# EAGLE design riser-1u-ethernet (EAGLE 6.2)
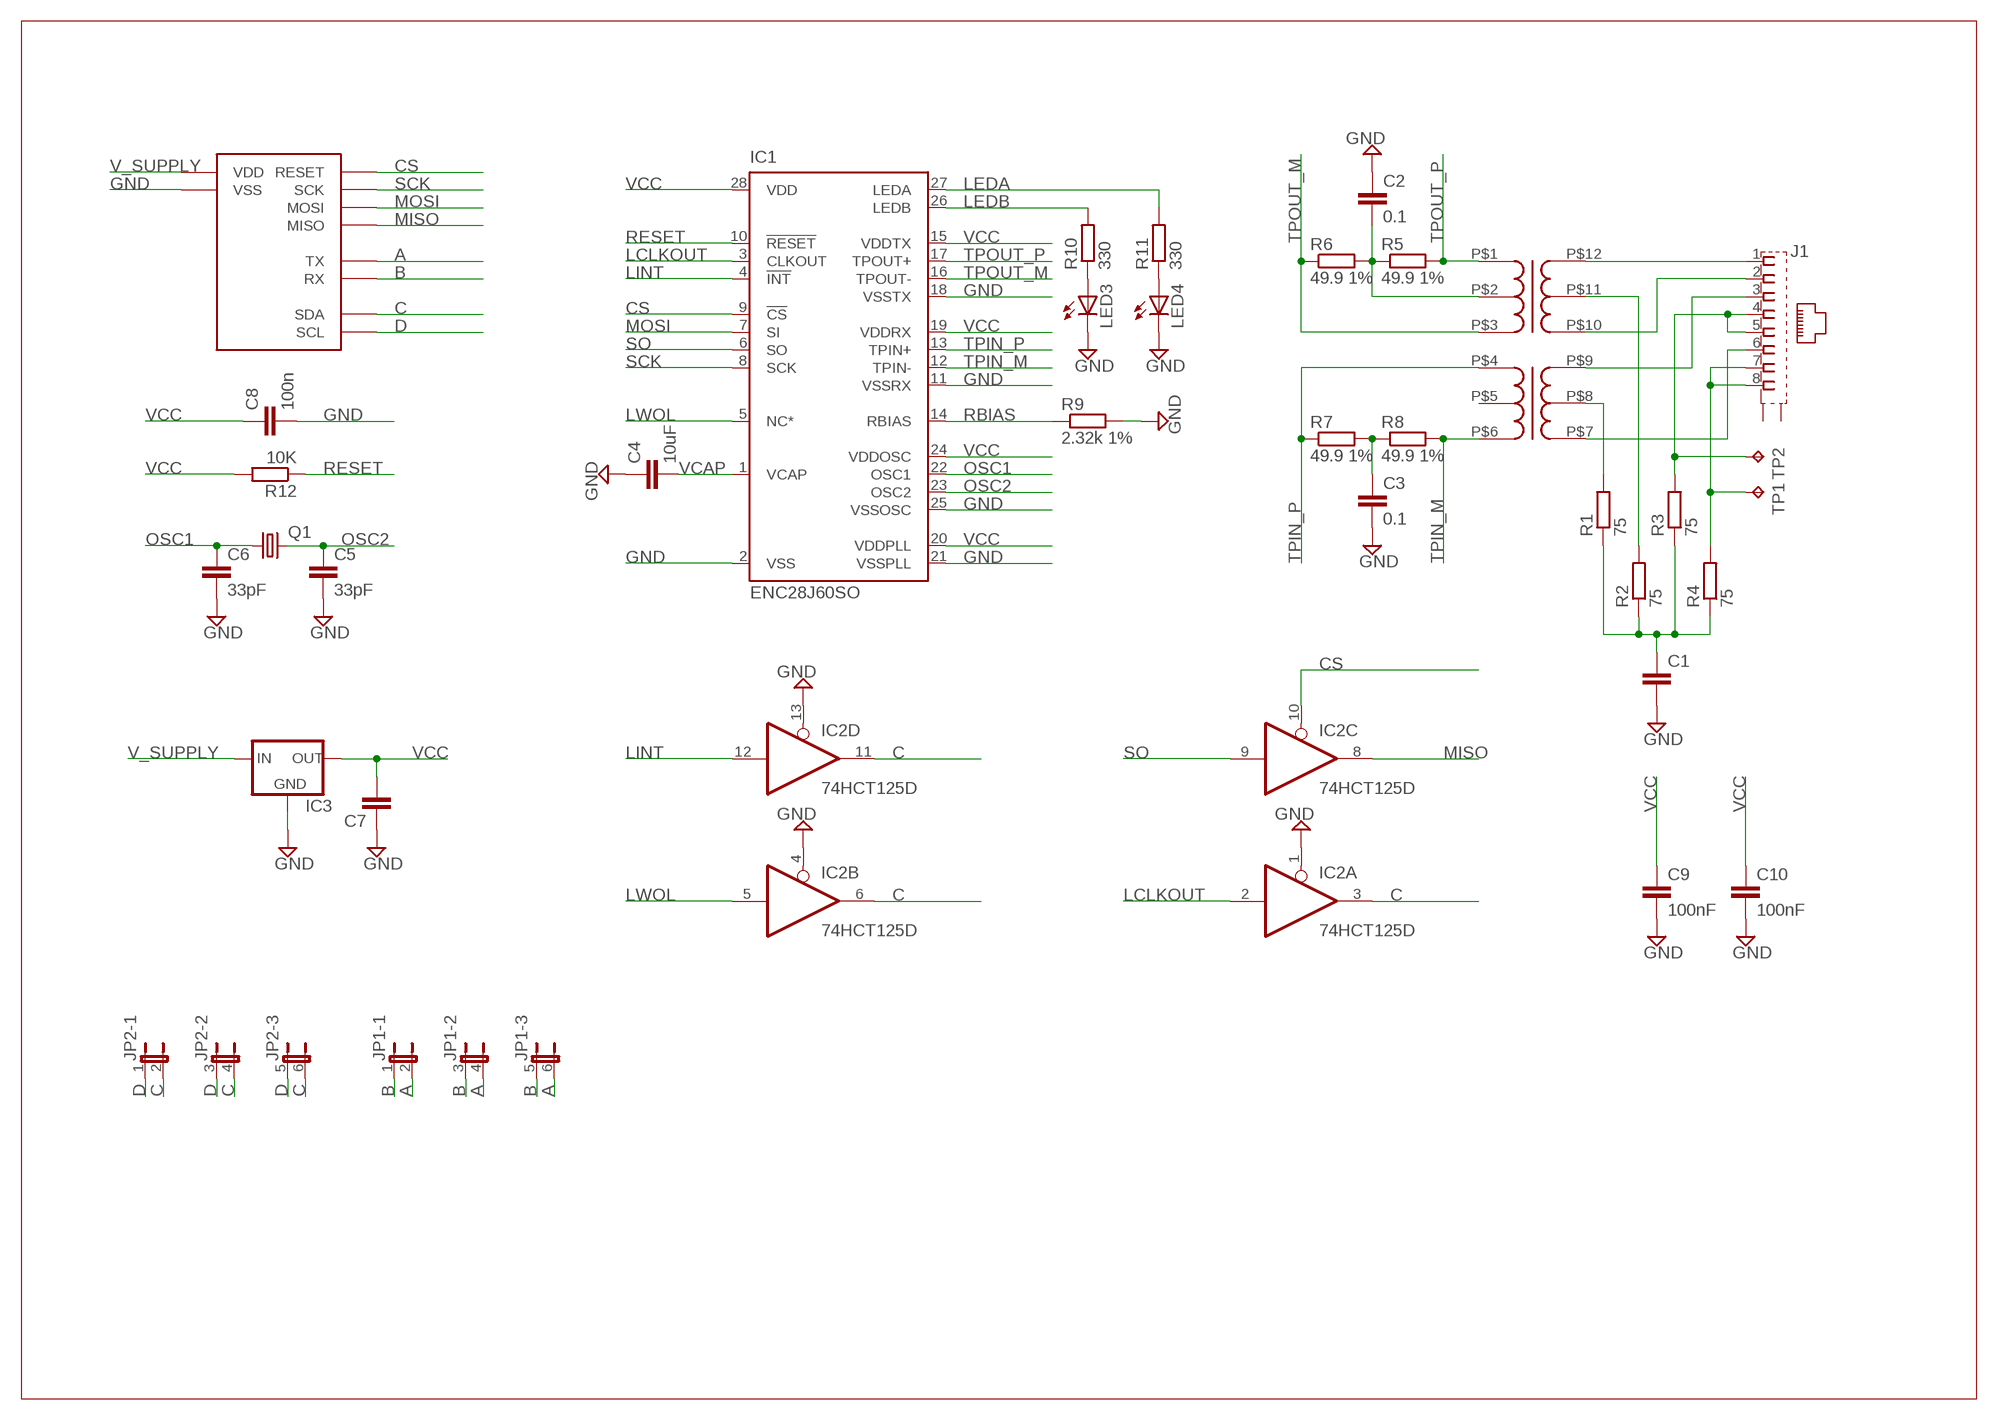
[diagram p0: schematic, sheet 1]

## Parts
C1  C-EU075-032X103  [C075-032X103]
C2  0.1  C-EUC0805  [C0805]
C3  0.1  C-EUC0805  [C0805]
C4  10uF  C-EUC1206  [C1206]
C5  33pF  C-EUC0805  [C0805]
C6  33pF  C-EUC0805  [C0805]
C7  C-EUC1206  [C1206]
C8  100n  C-EUC0805  [C0805]
C9  100nF  C-EUC0805  [C0805]
C10  100nF  C-EUC0805  [C0805]
IC1  ENC28J60SO  [SO28W]
IC2  74HCT125D  [SO14]
IC3  LM1117TO252  [TO252]
J1  555153-1  [555153-1]
JP1  JP3QE  [JP3Q]
JP2  JP3QE  [JP3Q]
LED3  LED3MM  [LED3MM]
LED4  LED3MM  [LED3MM]
Q1  CRYSTALHC49S  [HC49/S]
R1  75  R-EU_R0805  [R0805]
R2  75  R-EU_R0805  [R0805]
R3  75  R-EU_R0805  [R0805]
R4  75  R-EU_R0805  [R0805]
R5  49.9 1%  R-EU_R0805  [R0805]
R6  49.9 1%  R-EU_R0805  [R0805]
R7  49.9 1%  R-EU_R0805  [R0805]
R8  49.9 1%  R-EU_R0805  [R0805]
R9  2.32k 1%  R-EU_R0805  [R0805]
R10  330  R-EU_R0805  [R0805]
R11  330  R-EU_R0805  [R0805]
R12  10K  R-EU_R0805  [R0805]
TP1  TPPAD1-13  [P1-13]
TP2  TPPAD1-13  [P1-13]
U$1  UNI_BOARD_CONNECTOR_10  [UNI_BOARD_CONN_10]
U$2  ETHERNET_TRANSFORMER  [DIL-16-TRANSFORMER]

## Nets
A: JP1.2 JP1.4 JP1.6 U$1.C$7(TX)
B: JP1.1 JP1.3 JP1.5 U$1.C$9(RX)
C: IC2.3(A:O) IC2.6(B:O) IC2.11(D:O) JP2.2 JP2.4 JP2.6 U$1.C$8(SDA)
CS: IC1.9(!CS) IC2.10(C:OE) U$1.C$5(RESET)
D: JP2.1 JP2.3 JP2.5 U$1.C$10(SCL)
GND: C1.2 C2.1 C3.2 C4.1 C5.2 C6.2 C7.1 C8.2 C9.2 C10.2 IC1.2(VSS) IC1.11(VSSRX) IC1.18(VSSTX) IC1.21(VSSPLL) IC1.25(VSSOSC) IC2.1(A:OE) IC2.4(B:OE) IC2.13(D:OE) IC3.1(GND) LED3.K(C) LED4.K(C) R9.2 U$1.C$6(VSS)
LCLKOUT: IC1.3(CLKOUT) IC2.2(A:I)
LEDA: IC1.27(LEDA) R11.2
LEDB: IC1.26(LEDB) R10.2
LINT: IC1.4(!INT) IC2.12(D:I)
LWOL: IC1.5(NC*) IC2.5(B:I)
MISO: IC2.8(C:O) U$1.C$1(MISO)
MOSI: IC1.7(SI) U$1.C$4(MOSI)
N$1 [isolated]: J1.1 U$2.P$12(P16)
N$2 [isolated]: J1.2 U$2.P$10(P14)
N$3 [isolated]: J1.3 U$2.P$9(P11)
N$4 [isolated]: J1.6 U$2.P$7(P9)
N$5 [isolated]: R1.2 U$2.P$8(P10)
N$6 [isolated]: R2.2 U$2.P$11(P15)
N$7 [isolated]: J1.4 J1.5 R3.2 TP2.TP
N$8 [isolated]: J1.7 J1.8 R4.2 TP1.TP
N$9 [isolated]: C1.1 R1.1 R2.1 R3.1 R4.1
N$10: C2.2 R5.1 R6.2 U$2.P$2(P2)
N$11: C3.1 R7.2 R8.1
N$12: LED3.A R10.1
N$13: LED4.A R11.1
OSC1: C6.1 IC1.22(OSC1) Q1.1
OSC2: C5.1 IC1.23(OSC2) Q1.2
RBIAS: IC1.14(RBIAS) R9.1
RESET: IC1.10(!RESET) R12.1
SCK: IC1.8(SCK) U$1.C$3(SCK)
SO: IC1.6(SO) IC2.9(C:I)
TPIN_M: IC1.12(TPIN-) R8.2 U$2.P$6(P8)
TPIN_P: IC1.13(TPIN+) R7.1 U$2.P$4(P6)
TPOUT_M: IC1.16(TPOUT-) R6.1 U$2.P$3(P3)
TPOUT_P: IC1.17(TPOUT+) R5.2 U$2.P$1(P1)
V_SUPPLY: IC3.2(IN) U$1.C$2(VDD)
VCAP: C4.2 IC1.1(VCAP)
VCC: C7.2 C8.1 C9.1 C10.1 IC1.15(VDDTX) IC1.19(VDDRX) IC1.20(VDDPLL) IC1.24(VDDOSC) IC1.28(VDD) IC3.3(OUT) R12.2
Unconnected: J1.G1(S1) J1.G2(S2) U$2.P$5(P7)

## Power pins joined to a net without a drawn wire
GND: IC2.7(P:GND)
VCC: IC2.14(P:VCC)

## Library data of the parts
C1-C10 = rcl:C-EU: CAPACITOR, European symbol
IC1 = my-microchip-ENC28J60:ENC28J60: Stand-Alone Ethernet Controller with SPI Interface Source: http://ww1.microchip.com/downloads/en/DeviceDoc/39662c.pdf
IC2 = 74xx-eu:74*125: Quad bus BUFFER, 3-state
IC3 = my-v-reg-3:LM1117
J1 = con-amp:555153-1: AMP connector
JP1 JP2 = jumper:JP3QE: JUMPER
LED3 LED4 = led:LED: LED OSRAM: - CHIPLED LG R971, LG N971, LY N971, LG Q971, LY Q971, LO R971, LY R971 LH N974, LH R974 LS Q976, LO Q976, LY Q976 LO Q996 - Hyper CHIPLED LW Q18S LB Q993, LB Q99A, LB R99A - SideLED LS A670, LO A670, LY A670, LG A670, LP A670 LB A673, LV A673, LT A673, LW A673 LH A674 LY A675 LS A676, LA A676, LO A676, LY A676, LW A676 LS A679, LY A679, LG A679 - Hyper Micro SIDELED® LS Y876, LA Y876, LO Y876, LY Y876 LT Y87S - SmartLED LW L88C, LW L88S LB L89C, LB L89S, LG L890 LS L89K, LO L89K, LY L89K LS L896, LA L896, LO L896, LY L896 - TOPLED LS T670, LO T670, LY T670, LG T670, LP T670 LSG T670, LSP T670, LSY T670, LOP T670, LYG T670 LG T671, LOG T671, LSG T671 LB T673, LV T673, LT T673, LW T673 LH T674 LS T676, LA T676, LO T676, LY T676, LB T676, LH T676, LSB T676, LW T676 LB T67C, LV T67C, LT T67C, LS T67K, LO T67K, LY T67K, LW E67C LS E67B, LA E67B, LO E67B, LY E67B, LB E67C, LV E67C, LT E67C LW T67C LS T679, LY T679, LG T679 LS T770, LO T770, LY T770, LG T770, LP T770 LB T773, LV T773, LT T773, LW T773 LH T774 LS E675, LA E675, LY E675, LS T675 LS T776, LA T776, LO T776, LY T776, LB T776 LHGB T686 LT T68C, LB T68C - Hyper Mini TOPLED® LB M676 - Mini TOPLED Santana® LG M470 LS M47K, LO M47K, LY M47K Source: http://www.osram.convergy.de LUXEON: - LUMILED® LXK2-PW12-R00, LXK2-PW12-S00, LXK2-PW14-U00, LXK2-PW14-V00 LXK2-PM12-R00, LXK2-PM12-S00, LXK2-PM14-U00 LXK2-PE12-Q00, LXK2-PE12-R00, LXK2-PE12-S00, LXK2-PE14-T00, LXK2-PE14-U00 LXK2-PB12-K00, LXK2-PB12-L00, LXK2-PB12-M00, LXK2-PB14-N00, LXK2-PB14-P00, LXK2-PB14-Q00 LXK2-PR12-L00, LXK2-PR12-M00, LXK2-PR14-Q00, LXK2-PR14-R00 LXK2-PD12-Q00, LXK2-PD12-R00, LXK2-PD12-S00 LXK2-PH12-R00, LXK2-PH12-S00 LXK2-PL12-P00, LXK2-PL12-Q00, LXK2-PL12-R00 Source: www.luxeon.com KINGBRIGHT: KA-3528ASYC Source: www.kingbright.com
Q1 = crystal:CRYSTAL: CRYSTAL
R1-R12 = rcl:R-EU_: RESISTOR, European symbol
TP1 TP2 = testpad:TP: Test pad
U$1 = my-uni-board-conn:UNI_BOARD_CONNECTOR_10
U$2 = my-valor-FL1066:ETHERNET_TRANSFORMER

## Net classes
1 isolated: width 0.813 mm, clearance 2.54 mm

## Board
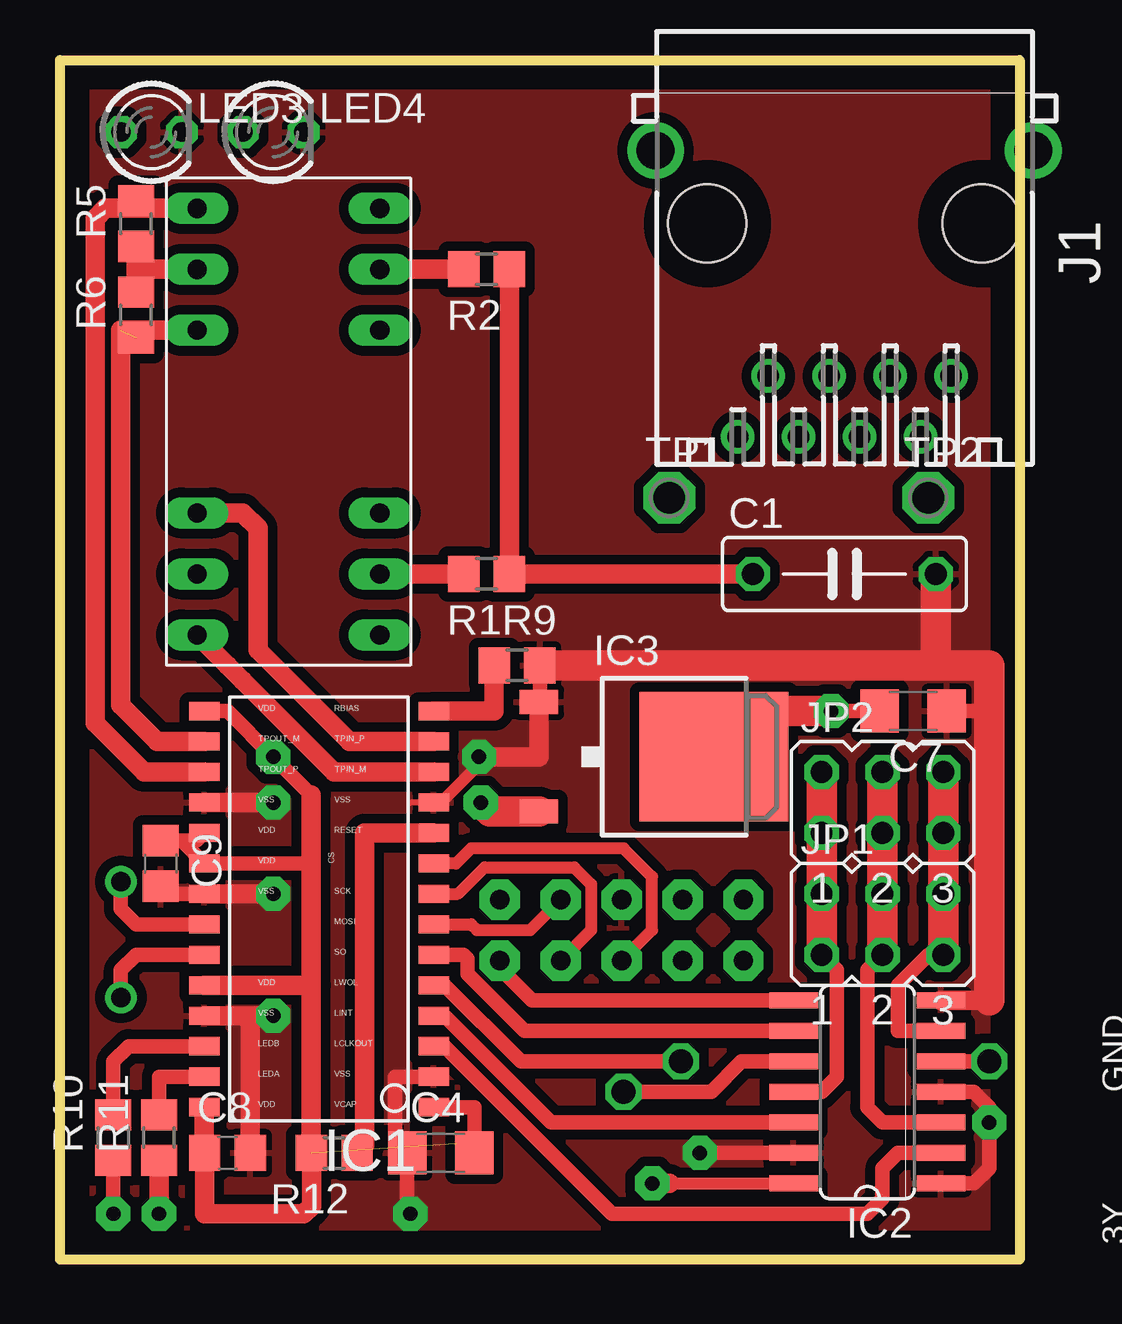
[diagram p1: board, top side]
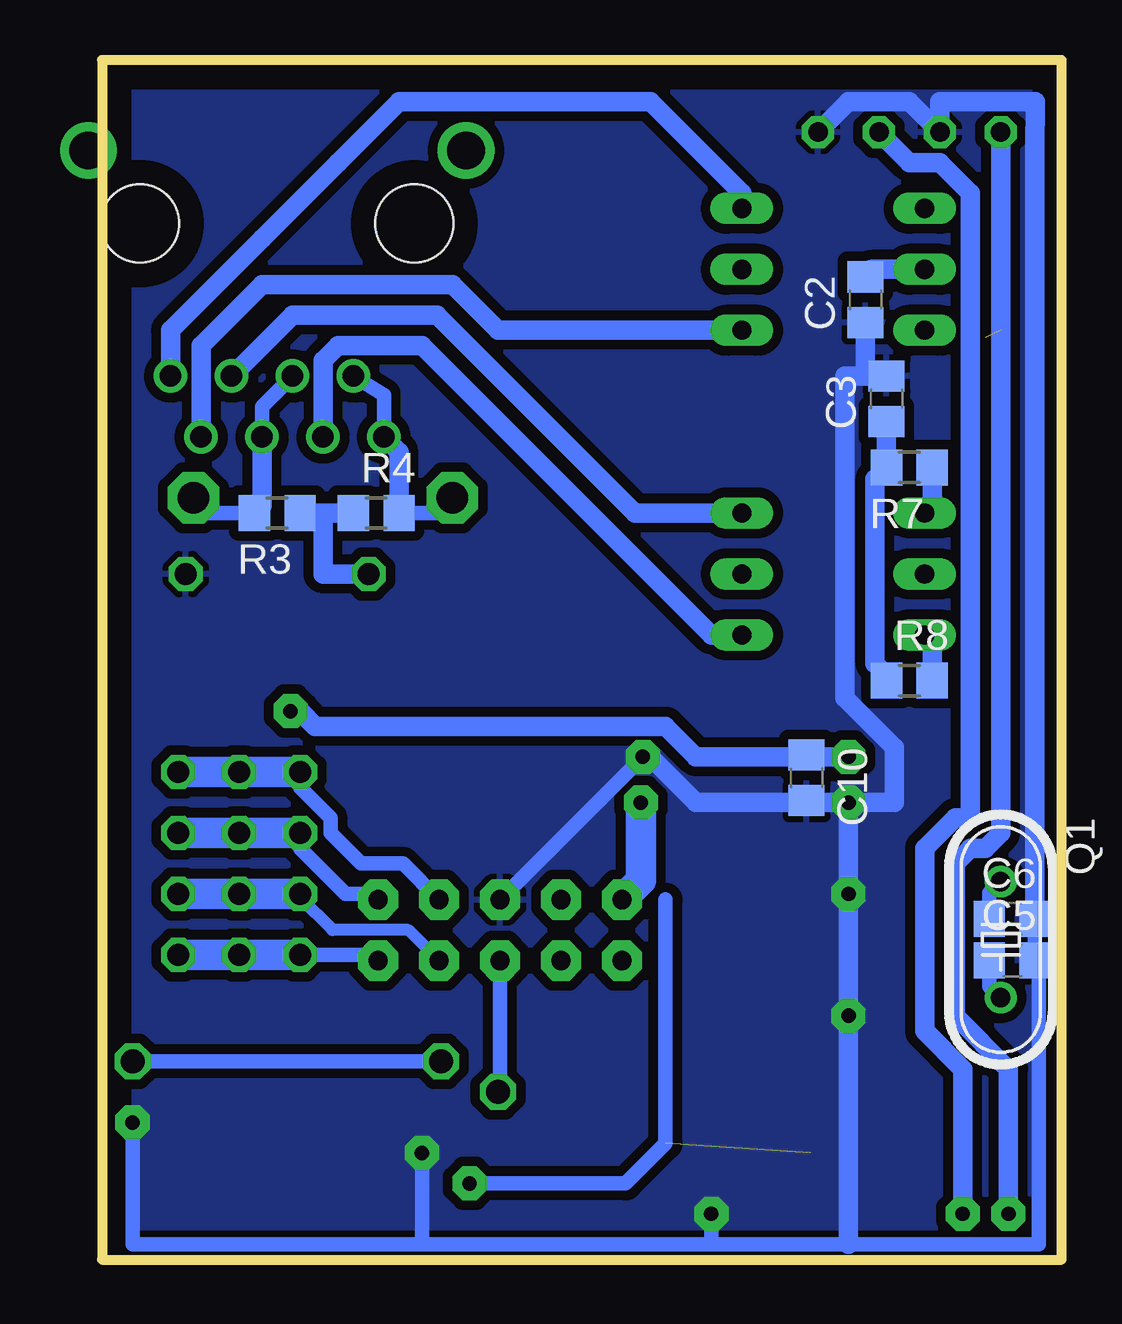
[diagram p2: board, bottom side, seen from below]

Size 40 x 50 mm. Coordinates in mm from the lower left corner, seen from the top.
Outline: 0,0 0,50 40,50 40,0 0,0
Copper layers (1*16): Top 0.035mm / dielectric 1.5mm / Bottom 0.035mm
Design rules: minimum track width 10mil, minimum drill 24mil, track to track 8mil, track to pad 8mil, pad to pad 8mil, via to via 8mil, smd to smd 8mil, copper to edge 40mil, drill to drill 8mil, minimum pad ring 10mil, minimum via ring 8mil, stop-mask expansion 4mil, vias tented up to drill 0mil, thermal gap 10mil

### Footprints (pad centres in the part's own frame; a part is rotated, then mirrored left to right if it is on the bottom)
C075-032X103 = drill 0.914 octagon: 1 -3.81,0; 2 3.81,0
C0805 = smd 1.3 x 1.5: 1 -0.95,0; 2 0.95,0
C1206 = smd 1.6 x 1.8: 1 -1.4,0; 2 1.4,0
SO28W = smd 0.762 x 1.27: 1 -7.62,-4.78; 2 -6.35,-4.78; 3 -5.08,-4.78; 4 -3.81,-4.78; 5 -2.54,-4.78; 6 -1.27,-4.78; 7 0,-4.78; 8 1.27,-4.78; 9 2.54,-4.78; 10 3.81,-4.78; 11 5.08,-4.78; 12 6.35,-4.78; 13 7.62,-4.78; 14 8.89,-4.78; 15 8.89,4.78; 16 7.62,4.78; 17 6.35,4.78; 18 5.08,4.78; 19 3.81,4.78; 20 2.54,4.78; 21 1.27,4.78; 22 0,4.78; 23 -1.27,4.78; 24 -2.54,4.78; 25 -3.81,4.78; 26 -5.08,4.78; 27 -6.35,4.78; 28 -7.62,4.78
SO14 = smd 0.66 x 2.032: 1 -3.81,-3.073; 2 -2.54,-3.073; 3 -1.27,-3.073; 4 0,-3.073; 5 1.27,-3.073; 6 2.54,-3.073; 7 3.81,-3.073; 8 3.81,3.073; 9 2.54,3.073; 10 1.27,3.073; 11 0,3.073; 12 -1.27,3.073; 13 -2.54,3.073; 14 -3.81,3.073
TO252 = smd 1 x 1.6: 1 -2.28,-6.07; 2 2.28,-6.07 | smd 5.4 x 6.2: 3 0,1.23
555153-1 = drill 0.889: 1 -4.445,6.35; 2 -3.175,8.89; 3 -1.905,6.35; 4 -0.635,8.89; 5 0.635,6.35; 6 1.905,8.89; 7 3.175,6.35; 8 4.445,8.89 | drill 1.575 pad 2.184: G1 -7.874,-3.048; G2 7.874,-3.048 | hole 3.251: -5.715,0; 5.715,0
JP3Q = drill 0.914 octagon: 1 -2.54,-1.27; 2 -2.54,1.27; 3 0,-1.27; 4 0,1.27; 5 2.54,-1.27; 6 2.54,1.27
LED3MM = drill 0.813 octagon: A -1.27,0; K 1.27,0
HC49/S = drill 0.813: 1 -2.413,0; 2 2.413,0
R0805 = smd 1.3 x 1.5: 1 -0.95,0; 2 0.95,0
P1-13 = drill 1.321 pad 2.159 octagon: TP 0,0
UNI_BOARD_CONN_10 = drill 0.8 pad 1.676 octagon: C$1 6.35,1.27; C$2 6.35,-1.27; C$3 3.81,1.27; C$4 3.81,-1.27; C$5 1.27,1.27; C$6 1.27,-1.27; C$7 -1.27,1.27; C$8 -1.27,-1.27; C$9 -3.81,1.27; C$10 -3.81,-1.27
DIL-16-TRANSFORMER = drill 0.8 long: P$1 -3.81,8.89; P$2 -3.81,6.35; P$3 -3.81,3.81; P$4 -3.81,-3.81; P$5 -3.81,-6.35; P$6 -3.81,-8.89; P$7 3.81,-8.89; P$8 3.81,-6.35; P$9 3.81,-3.81; P$10 3.81,3.81; P$11 3.81,6.35; P$12 3.81,8.89

### Placement (x,y rotation side)
C1  32.7,28.57 0 top
C2  8.18,40.01 90 bottom
C3  7.3,35.88 90 bottom
C4  15.88,4.45 0 top
C5  2.06,12.46 0 bottom
C6  2.06,14.21 0 bottom
C7  35.56,22.86 180 top
C8  6.99,4.45 0 top
C9  4.21,16.51 270 top
C10  10.64,20.08 270 bottom
IC1  10.79,13.97 90 top
IC2  33.66,6.99 90 top
IC3  26.04,20.95 270 top
J1  32.7,43.18 180 top
JP1  34.29,13.97 0 top
JP2  34.29,19.05 0 top
LED3  3.81,46.99 0 top
LED4  8.89,46.99 0 top
Q1  2.54,13.34 270 bottom
R1  17.78,28.57 180 top
R2  17.78,41.27 180 top
R3  32.7,31.11 180 bottom
R4  28.57,31.11 0 bottom
R5  3.17,43.18 90 top
R6  3.17,39.37 90 top
R7  6.35,33.02 180 bottom
R8  6.35,24.13 0 bottom
R9  19.05,24.77 0 top
R10  2.22,5.08 90 top
R11  4.13,5.08 90 top
R12  11.43,4.45 180 top
TP1  25.4,31.75 0 top
TP2  36.2,31.75 0 top
U$1  24.68,13.73 180 top
U$2  9.53,34.92 0 top

### Tracks (layer width: path | path; a pad name or v marks a point on that pad's centre or on a via)
A
  Bottom 0.508: U$1.C$7 27.23,13.73 30.4,13.73 31.75,15.08 JP1.2
  Bottom 1.27: JP1.2 JP1.4 JP1.6
B
  Bottom 0.61: U$1.C$9 28.73,12.7 JP1.1
  Bottom 1.27: JP1.1 JP1.3 JP1.5
C
  Top 0.61: IC2.6 34.92,9.53 34.92,11.43 36.2,12.7 36.83,12.7 | 34.29,12.7 33.66,12.06 33.66,6.35 34.29,5.71 IC2.3 | IC2.11 31.75,6.99 32.38,7.62 32.38,12.06 31.75,12.7
  Top 1.27: JP2.6 36.83,12.7 | JP2.4 34.29,12.7 | 31.75,12.7 JP2.2
  Bottom 0.61: U$1.C$8 27.46,16.51 29.21,16.51 30.48,17.78 30.48,18.41 31.75,19.68 JP2.2
  Bottom 1.27: JP2.2 JP2.4 JP2.6
CS  (via drill 1 pad 1.02)
  Top 0.508: IC1.9 16.51,16.51 17.14,17.14 23.5,17.14 24.69,15.95 24.69,13.73 U$1.C$5
  Top 0.61: v23.5,6.99 27.15,6.99 28.42,8.26 IC2.10
  Bottom 0.61: U$1.C$5 23.41,7.07 v23.5,6.99
D
  Bottom 0.61: U$1.C$10 28.73,15.24 29.84,15.24 31.75,17.14 JP2.1
  Bottom 1.27: JP2.1 JP2.3 JP2.5
GND  (via drill 0.6 pad 1.42)
  Top 0.254: IC1.11 15.3,19.05 14.61,19.05
  Top 0.508: IC1.11 15.88,19.05 17.78,20.95
  Top 0.61: R9.2 20,23.27 IC3.1 | IC1.2 13.97,7.62 13.97,4.32 | 13.97,4.32 14.47,3.81 14.47,2.04 v14.61,1.91 | v17.46,20.95 17.78,20.95 | IC2.4 38.1,6.99 38.73,6.35 v38.73,5.71 38.73,3.81 38.1,3.17 IC2.1 | v26.67,4.45 IC2.13 | C4.1 13.97,4.45 13.97,4.32 | 38.73,22.86 C7.1 | C9.2 4.53,15.24 IC1.21
  Top 0.813: v8.89,19.05 IC1.18 | v8.89,10.16 7.86,10.16 | 7.86,10.16 IC1.25 | 38.73,10.79 IC2.7 | C8.2 7.93,10.08 7.86,10.16 | 17.78,20.95 19.96,20.95 IC3.1 | v8.89,15.24 IC1.21 v8.89,15.24
  Top 1.27: R9.2 36.51,24.77 | 36.51,24.77 C1.2 | 38.73,10.79 38.73,22.86 38.73,24.77 36.51,24.77
  Bottom 0.61: C5.2 C6.2 | C5.2 | 23.25,15 U$1.C$6 v17.46,20.95 | 14.61,0.64 8.89,0.64 0.95,0.64 0.95,12.3 C5.2 | 14.61,0.64 22.15,0.64 26.67,0.64 | 14.61,0.64 v14.61,1.91 | v38.73,5.71 38.73,0.64 26.67,0.64 | 26.67,0.64 v26.67,4.45 | C10.2 8.89,19.13 v8.89,19.05
  Bottom 0.813: LED4.K 8.89,48.26 6.35,48.26 LED3.K 5.08,48.26 1.11,48.26 1.11,46.2 C6.2 | v8.89,19.05 v8.89,15.24 8.89,10.79 v8.89,10.16 8.89,0.64 | v17.46,20.95 17.14,20.95 15.24,19.05 v8.89,19.05 | 8.26,36.83 9.05,36.83 9.05,23.42 6.99,21.35 6.99,19.05 v8.89,19.05 | 8.26,36.83 C3.2 | C2.1 8.18,36.91 arc90 8.26,36.83
  pour Bottom (isolate 0.406): 0,50.16 40.01,50.16 40.01,0 0,0
  pour Top (isolate 0.406): 0,50.16 40.01,50.16 40.01,0 0,0
LCLKOUT
  Top 0.61: IC1.3 16.03,8.89 23.02,1.91 33.66,1.91 34.29,2.54 34.29,3.81 34.92,4.45 IC2.2
LEDA
  Top 0.61: IC1.27 4.13,7.62 R11.2
LEDB
  Top 0.61: IC1.26 2.86,8.89 2.22,8.26 R10.2
LINT
  Top 0.254: IC1.4 15.36,10.16
  Top 0.61: IC1.4 16.03,10.16 20.48,5.71 IC2.12
LWOL  (via drill 1 pad 1.02)
  Top 0.61: IC1.5 16.03,11.43 19.21,8.26 v25.88,8.26 | v38.73,8.26 IC2.5
  Bottom 0.61: v25.88,8.26 v38.73,8.26
MISO
  Top 0.61: IC2.8 19.68,10.79 18.34,12.14 U$1.C$1
MOSI
  Top 0.508: U$1.C$4 19.61,13.73 17.38,13.73 17.14,13.97 IC1.7
N$1
  Bottom 0.813: J1.1 37.15,38.73 33.34,42.55 30.16,45.72 27.62,48.26 17.14,48.26 13.34,44.45 U$2.P$12
N$2
  Bottom 0.813: J1.2 35.88,38.1 33.34,40.64 25.4,40.64 23.5,38.73 U$2.P$10
N$3
  Bottom 0.813: U$2.P$9 17.78,31.11 26.04,39.37 32.07,39.37 J1.3
N$4
  Bottom 0.813: J1.6 30.8,37.47 30.16,38.1 26.67,38.1 14.61,26.04 U$2.P$7
N$5
  Top 0.813: U$2.P$8 R1.2
N$6
  Top 0.813: U$2.P$11 R2.2
N$7
  Bottom 0.61: J1.5 33.34,35.56 J1.4 | TP2.TP 35.56,31.11 R3.2
  Bottom 0.813: J1.4 33.34,31.43 R3.2
N$8
  Bottom 0.61: J1.8 28.26,36.04 J1.7 | TP1.TP 26.04,31.11 R4.2
  Bottom 0.813: R4.2 27.62,33.66 J1.8
N$9
  Top 0.813: R2.1 R1.1 C1.1
  Bottom 0.813: 30.8,31.11 R3.1 | 30.8,31.11 30.8,28.57 C1.1 | 30.8,31.11 R4.1
N$10
  Top 0.813: 3.17,41.27 R5.1 | 3.17,41.27 U$2.P$2 | R6.2 3.17,41.27
  Bottom 0.813: U$2.P$2 7.86,41.27 arc-90 C2.2
N$11
  Bottom 0.813: R8.1 7.3,24.37 7.78,24.84 7.78,32.54 R7.2 arc90 R7.2 C3.1
N$12  (via drill 0.6 pad 1.42)
  Top 0.61: v2.22,1.91 R10.1
  Bottom 0.813: LED3.A 2.54,45.09 2.54,17.78 3.17,17.14 3.81,17.14 4.45,16.51 4.45,10.16 2.22,7.94 v2.22,1.91
N$13  (via drill 0.6 pad 1.42)
  Top 0.813: v4.13,1.91 R11.1
  Bottom 0.813: LED4.A 6.35,45.72 5.08,45.72 3.81,44.45 3.81,18.41 4.45,18.41 5.71,17.14 5.71,9.53 4.13,7.94 v4.13,1.91
OSC1
  Top 0.61: IC1.22 3.17,13.97 2.54,14.61 Q1.1
  Bottom 0.61: C6.1 3.01,15.27 Q1.1
OSC2
  Top 0.61: IC1.23 3.17,12.7 2.54,12.06 Q1.2
  Bottom 0.61: C5.1 3.01,11.4 Q1.2
RBIAS
  Top 0.813: R9.1 18.1,22.86 IC1.14
RESET
  Top 0.813: IC1.10 12.7,17.78 12.7,4.76 R12.1
SCK
  Top 0.508: U$1.C$3 22.15,13.73 22.15,15.64 21.43,16.35 17.7,16.35 16.59,15.24 IC1.8
SO
  Top 0.61: IC1.6 16.83,12.7 16.99,12.54 16.99,11.91 19.37,9.53 IC2.9
TPIN_M
  Top 0.813: U$2.P$6 6.99,24.77 7.62,24.13 11.43,20.32 IC1.12
  Bottom 0.813: 6.35,26.04 U$2.P$6 5.4,25.72 R8.2
TPIN_P
  Top 0.813: U$2.P$4 7.62,31.11 8.26,30.48 8.26,25.4 12.06,21.59 IC1.13
  Bottom 0.813: R7.1 5.4,31.43 U$2.P$4
TPOUT_M  (1 unrouted)
  Top 0.813: U$2.P$3 2.53,38.73 2.53,23.12 4.06,21.59 IC1.16
TPOUT_P
  Top 0.813: 3.17,43.81 1.89,43.81 1.46,43.38 1.46,22.36 3.5,20.32 IC1.17 | 3.17,43.81 U$2.P$1 | 3.17,43.81 R5.2
V_SUPPLY  (via drill 0.6 pad 1.42)
  Top 1.27: v17.54,19.05 17.92,18.68 IC3.2
  Bottom 1.27: U$1.C$2 17.54,15.79 v17.54,19.05
VCAP
  Top 0.61: IC1.1 17.27,6.35 C4.2
VCC  (via drill 0.6 pad 1.42)  (1 unrouted)
  Top 0.508: 25.4,3.17 IC2.14
  Top 0.61: 10.48,16.51 IC1.20 5.07,17.46 C9.1 | IC1.15 6.99,22.86 v8.89,20.95 10.48,19.37 | v32.15,22.86 C7.2 | C9.1 4.21,17.78 | IC1.19 5.7,17.46 C9.1
  Top 0.813: v24.69,3.17 25.4,3.17 | 10.48,19.37 10.48,16.51 10.48,11.43 | IC1.28 6.01,4.46 C8.1 6.03,1.91 10.16,1.91 10.48,2.23 R12.2 10.48,11.43 | 10.48,11.43 IC1.24
  Top 1.27: v32.15,22.86 27.9,22.86 IC3.3
  Bottom 0.61: v24.69,3.17 18.18,3.17 16.51,4.84 16.51,15 | C10.1 8.89,21.03 v8.89,20.95
  Bottom 0.813: v8.89,20.95 15.24,20.95 16.51,22.23 31.11,22.23 31.75,22.86 v32.15,22.86

### Text on the board
tOrigins: VDD | MOSI | VSS | SDA | SCL | TX | RX | MISO | SCK | RESET | RX
tNames: VDD | RBIAS | TPOUT_M | TPIN_P | TPOUT_P | TPIN_M | VSS | VSS | VDD | RESET | VDD | CS | VSS | SCK | MOSI | SO | VDD | LWOL | VSS | LINT | LEDB | LCLKOUT | LEDA | VSS | GND | 2Y | 2A | 2OE | 1Y | 1A | 1OE | VDD | VCAP | 3Y | 3A | 3OE | 4Y | 4A | 4OE | VCC